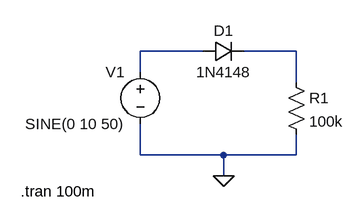
[diagram p0: schematic circuito_rettificatore.asc]
circuito_rettificatore.asc, the LTspice schematic file:
Version 4
SHEET 1 880 680
WIRE 176 96 80 96
WIRE 320 96 240 96
WIRE 80 128 80 96
WIRE 320 144 320 96
WIRE 80 256 80 208
WIRE 208 256 80 256
WIRE 320 256 320 224
WIRE 320 256 208 256
WIRE 208 288 208 256
FLAG 208 288 0
SYMBOL voltage 80 112 M0
WINDOW 123 0 0 Left 0
WINDOW 39 0 0 Left 0
SYMATTR InstName V1
SYMATTR Value SINE(0 10 50)
SYMBOL diode 176 112 R270
WINDOW 0 32 32 VTop 2
WINDOW 3 0 32 VBottom 2
SYMATTR InstName D1
SYMATTR Value 1N4148
SYMBOL res 304 128 R0
SYMATTR InstName R1
SYMATTR Value 100k
TEXT -104 312 Left 2 !.tran 100m

The netlist it stands for:
* circuito_rettificatore.asc
V1 N001 0 SINE(0 10 50)
D1 N001 N002 1N4148
R1 N002 0 100k
.model D D
.lib standard.dio
.tran 100m
.backanno
.end